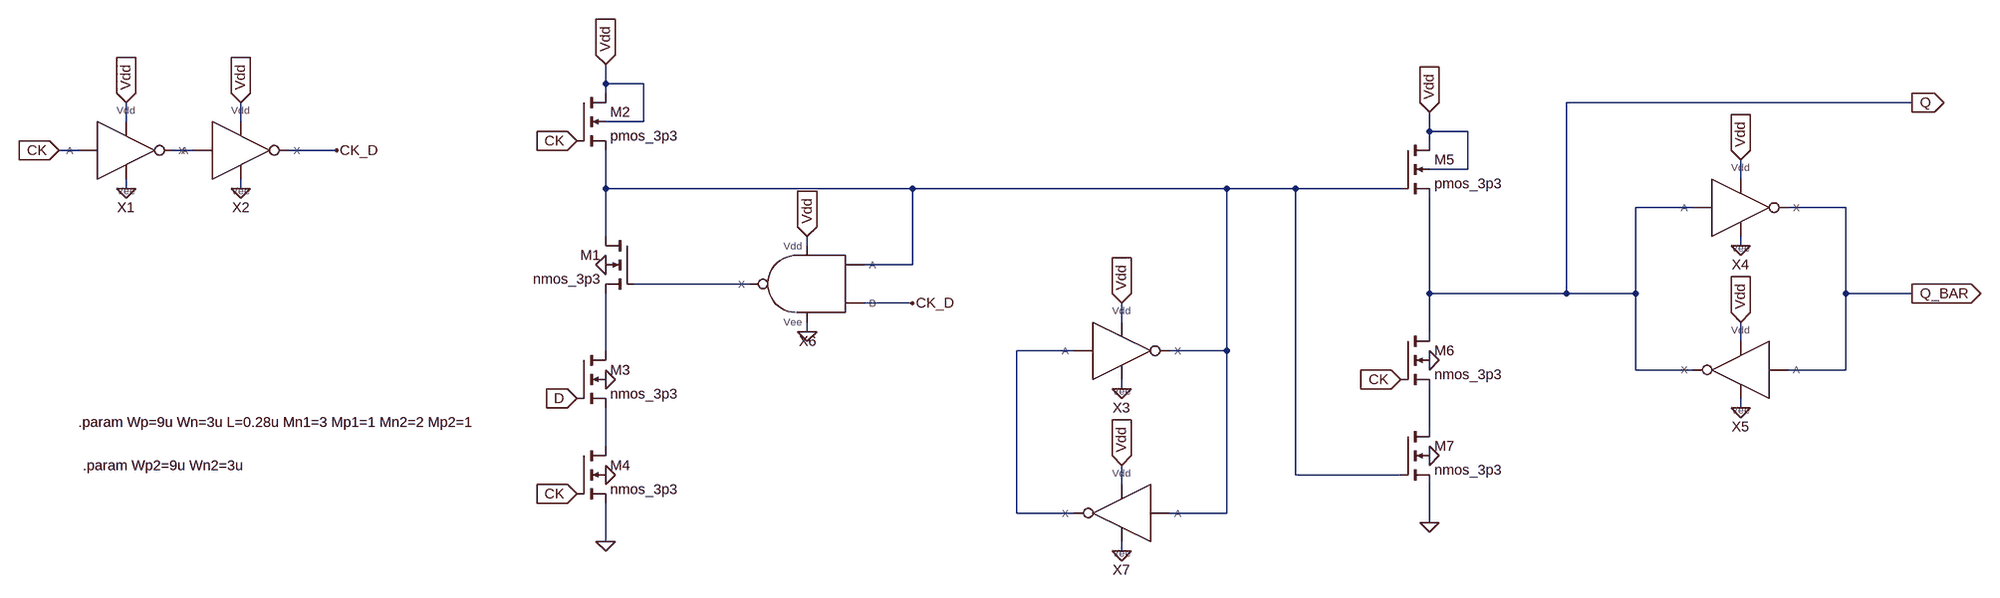
[diagram p0: schematic SDFF.asc]
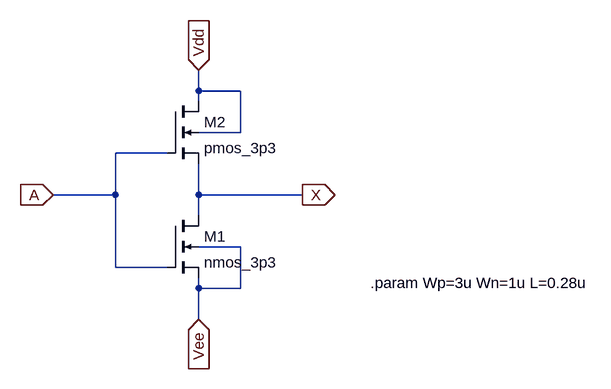
[diagram p1: sub-circuit invx1.asc]
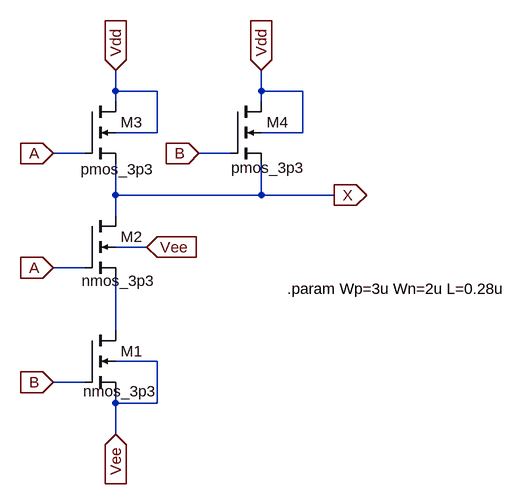
[diagram p2: sub-circuit nand2x1.asc]
SDFF.asc, the LTspice schematic file:
Version 4
SHEET 1 2380 680
WIRE -528 -304 -528 -336
WIRE -464 -304 -528 -304
WIRE -528 -288 -528 -304
WIRE 2240 -272 1488 -272
WIRE -1472 -240 -1472 -272
WIRE -1280 -240 -1280 -272
WIRE -464 -240 -464 -304
WIRE -464 -240 -528 -240
WIRE 1104 -224 1104 -256
WIRE 1168 -224 1104 -224
WIRE 1104 -208 1104 -224
WIRE -1552 -192 -1584 -192
WIRE -1360 -192 -1392 -192
WIRE -1120 -192 -1200 -192
WIRE 1168 -160 1168 -224
WIRE 1168 -160 1104 -160
WIRE 1888 -144 1888 -176
WIRE -1472 -128 -1472 -144
WIRE -1280 -128 -1280 -144
WIRE -528 -128 -528 -192
WIRE 32 -128 -528 -128
WIRE 640 -128 32 -128
WIRE 880 -128 640 -128
WIRE 1056 -128 880 -128
WIRE 1808 -96 1712 -96
WIRE 2064 -96 1968 -96
WIRE -528 -48 -528 -128
WIRE -144 -32 -144 -48
WIRE 1888 -32 1888 -48
WIRE 32 0 32 -128
WIRE 32 0 -48 0
WIRE -240 32 -480 32
WIRE 1104 48 1104 -112
WIRE 1488 48 1488 -272
WIRE 1488 48 1104 48
WIRE 1712 48 1712 -96
WIRE 1712 48 1488 48
WIRE 2064 48 2064 -96
WIRE 2240 48 2064 48
WIRE 32 64 -48 64
WIRE 464 96 464 64
WIRE -144 112 -144 96
WIRE 1104 112 1104 48
WIRE 1888 128 1888 96
WIRE -528 144 -528 48
WIRE 384 144 288 144
WIRE 640 144 640 -128
WIRE 640 144 544 144
WIRE 1712 176 1712 48
WIRE 1808 176 1712 176
WIRE 2064 176 2064 48
WIRE 2064 176 1968 176
WIRE 464 208 464 192
WIRE 1888 240 1888 224
WIRE 1104 272 1104 208
WIRE -528 304 -528 240
WIRE 880 352 880 -128
WIRE 1056 352 880 352
WIRE 464 368 464 336
WIRE 288 416 288 144
WIRE 384 416 288 416
WIRE 640 416 640 144
WIRE 640 416 544 416
WIRE 1104 432 1104 368
WIRE -528 464 -528 400
WIRE 464 480 464 464
FLAG -528 -336 Vdd
IOPIN -528 -336 In
FLAG -576 -208 CK
IOPIN -576 -208 In
FLAG -528 464 0
FLAG -576 224 D
IOPIN -576 224 In
FLAG -1472 -128 0
FLAG -1280 -128 0
FLAG -1472 -272 Vdd
IOPIN -1472 -272 In
FLAG -1280 -272 Vdd
IOPIN -1280 -272 In
FLAG -1584 -192 CK
IOPIN -1584 -192 In
FLAG -1120 -192 CK_D
FLAG 1888 -32 0
FLAG 1888 240 0
FLAG 1888 -176 Vdd
IOPIN 1888 -176 In
FLAG 1888 96 Vdd
IOPIN 1888 96 In
FLAG 2240 -272 Q
IOPIN 2240 -272 Out
FLAG 2240 48 Q_BAR
IOPIN 2240 48 Out
FLAG -528 352 0
FLAG -528 192 0
FLAG -528 0 0
FLAG 1104 -256 Vdd
IOPIN 1104 -256 In
FLAG 1104 432 0
FLAG 1104 320 0
FLAG 1104 160 0
FLAG -576 384 CK
IOPIN -576 384 In
FLAG 32 64 CK_D
FLAG -144 -48 Vdd
IOPIN -144 -48 In
FLAG -144 112 0
FLAG 464 208 0
FLAG 464 480 0
FLAG 464 64 Vdd
IOPIN 464 64 In
FLAG 464 336 Vdd
IOPIN 464 336 In
FLAG 1056 192 CK
IOPIN 1056 192 In
SYMBOL nmos4 -576 -288 R0
SYMATTR InstName M2
SYMATTR Value pmos_3p3
SYMATTR Value2 l={L} w={Wp} m={Mp1}
SYMBOL nmos4 -576 144 R0
SYMATTR InstName M3
SYMATTR Value nmos_3p3
SYMATTR Value2 l={L} w={Wn} m={Mn1}
SYMBOL nmos4 -576 304 R0
SYMATTR InstName M4
SYMATTR Value nmos_3p3
SYMATTR Value2 l={L} w={Wn} m={Mn1}
SYMBOL INVx1 -1472 -192 R0
SYMATTR InstName X1
SYMBOL INVx1 -1280 -192 R0
SYMATTR InstName X2
SYMBOL INVx1 1888 -96 R0
SYMATTR InstName X4
SYMBOL INVx1 1888 176 M0
SYMATTR InstName X5
SYMBOL nmos4 -480 -48 M0
SYMATTR InstName M1
SYMATTR Value nmos_3p3
SYMATTR Value2 l={L} w={Wn} m={Mn1}
SYMBOL NAND2x1 -144 32 M0
SYMATTR InstName X6
SYMBOL nmos4 1056 -208 R0
SYMATTR InstName M5
SYMATTR Value pmos_3p3
SYMATTR Value2 l={L} w={Wp2} m={Mp2}
SYMBOL nmos4 1056 112 R0
SYMATTR InstName M6
SYMATTR Value nmos_3p3
SYMATTR Value2 l={L} w={Wn2} m={Mn2}
SYMBOL nmos4 1056 272 R0
SYMATTR InstName M7
SYMATTR Value nmos_3p3
SYMATTR Value2 l={L} w={Wn2} m={Mn2}
SYMBOL INVx1 464 144 R0
SYMATTR InstName X3
SYMBOL INVx1 464 416 M0
SYMATTR InstName X7
TEXT -1552 264 Left 2 !.param Wp=9u Wn=3u L=0.28u Mn1=3 Mp1=1 Mn2=2 Mp2=1
TEXT -1544 336 Left 2 !.param Wp2=9u Wn2=3u

invx1.asc, the sub-circuit schematic file:
Version 4
SHEET 1 2776 836
WIRE 416 -16 416 -48
WIRE 480 -16 416 -16
WIRE 416 0 416 -16
WIRE 480 48 480 -16
WIRE 480 48 416 48
WIRE 368 80 288 80
WIRE 288 144 288 80
WIRE 288 144 192 144
WIRE 416 144 416 96
WIRE 576 144 416 144
WIRE 416 176 416 144
WIRE 480 224 416 224
WIRE 288 256 288 144
WIRE 368 256 288 256
WIRE 416 288 416 272
WIRE 480 288 480 224
WIRE 480 288 416 288
WIRE 416 336 416 288
FLAG 416 -48 Vdd
IOPIN 416 -48 In
FLAG 192 144 A
IOPIN 192 144 In
FLAG 576 144 X
IOPIN 576 144 Out
FLAG 416 336 Vee
IOPIN 416 336 In
SYMBOL nmos4 368 176 R0
SYMATTR InstName M1
SYMATTR Value nmos_3p3
SYMATTR Value2 l={L} w={Wn}
SYMBOL nmos4 368 0 R0
SYMATTR InstName M2
SYMATTR Value pmos_3p3
SYMATTR Value2 l={L} w={Wp}
TEXT 680 280 Left 2 !.param Wp=3u Wn=1u L=0.28u

nand2x1.asc, the sub-circuit schematic file:
Version 4.1
SHEET 1 900 680
WIRE -96 32 -96 0
WIRE -32 32 -96 32
WIRE 128 32 128 0
WIRE 192 32 128 32
WIRE -96 48 -96 32
WIRE 128 48 128 32
WIRE -32 96 -32 32
WIRE -32 96 -96 96
WIRE 192 96 192 32
WIRE 192 96 128 96
WIRE -144 128 -192 128
WIRE 80 128 32 128
WIRE -96 192 -96 144
WIRE 128 192 128 144
WIRE 128 192 -96 192
WIRE 240 192 128 192
WIRE -96 224 -96 192
WIRE -48 272 -96 272
WIRE -144 304 -192 304
WIRE -96 400 -96 320
WIRE -32 448 -96 448
WIRE -144 480 -192 480
WIRE -96 512 -96 496
WIRE -32 512 -32 448
WIRE -32 512 -96 512
WIRE -96 560 -96 512
FLAG -96 0 Vdd
IOPIN -96 0 In
FLAG -192 128 A
IOPIN -192 128 In
FLAG 240 192 X
IOPIN 240 192 Out
FLAG 128 0 Vdd
IOPIN 128 0 In
FLAG -192 304 A
IOPIN -192 304 In
FLAG -192 480 B
IOPIN -192 480 In
FLAG 32 128 B
IOPIN 32 128 In
FLAG -96 560 Vee
IOPIN -96 560 In
FLAG -48 272 Vee
IOPIN -48 272 In
SYMBOL nmos4 -144 400 R0
WINDOW 3 -2 94 Left 2
SYMATTR Value nmos_3p3
SYMATTR InstName M1
SYMATTR Value2 l={L} w={Wn}
SYMBOL nmos4 -144 48 R0
WINDOW 3 -6 104 Left 2
SYMATTR Value pmos_3p3
SYMATTR InstName M3
SYMATTR Value2 l={L} w={Wp}
SYMBOL nmos4 80 48 R0
WINDOW 3 2 102 Left 2
SYMATTR Value pmos_3p3
SYMATTR InstName M4
SYMATTR Value2 l={L} w={Wp}
SYMBOL nmos4 -144 224 R0
WINDOW 3 -4 100 Left 2
SYMATTR Value nmos_3p3
SYMATTR InstName M2
SYMATTR Value2 l={L} w={Wn}
TEXT 168 336 Left 2 !.param Wp=3u Wn=2u L=0.28u

The netlist it stands for:
* SDFF.asc
M2 Vdd CK N002 Vdd pmos_3p3 l={L} w={Wp} m={Mp1}
M3 N004 D N007 0 nmos_3p3 l={L} w={Wn} m={Mn1}
M4 N007 CK 0 0 nmos_3p3 l={L} w={Wn} m={Mn1}
XX1 CK Vdd N001 0 invx1
XX2 N001 Vdd CK_D 0 invx1
XX4 Q Vdd Q_BAR 0 invx1
XX5 Q_BAR Vdd Q 0 invx1
M1 N002 N003 N004 0 nmos_3p3 l={L} w={Wn} m={Mn1}
XX6 N002 CK_D Vdd N003 0 nand2x1
M5 Vdd N002 Q Vdd pmos_3p3 l={L} w={Wp2} m={Mp2}
M6 Q CK N006 0 nmos_3p3 l={L} w={Wn2} m={Mn2}
M7 N006 N002 0 0 nmos_3p3 l={L} w={Wn2} m={Mn2}
XX3 N005 Vdd N002 0 invx1
XX7 N002 Vdd N005 0 invx1

* block symbol definitions
.subckt invx1 A Vdd X Vee
M1 X A Vee Vee nmos_3p3 l={L} w={Wn}
M2 Vdd A X Vdd pmos_3p3 l={L} w={Wp}
.param Wp=3u Wn=1u L=0.28u
.ends invx1

.subckt nand2x1 A B Vdd X Vee
M1 N001 B Vee Vee nmos_3p3 l={L} w={Wn}
M3 Vdd A X Vdd pmos_3p3 l={L} w={Wp}
M4 Vdd B X Vdd pmos_3p3 l={L} w={Wp}
M2 X A N001 Vee nmos_3p3 l={L} w={Wn}
.param Wp=3u Wn=2u L=0.28u
.ends nand2x1

.model NMOS NMOS
.model PMOS PMOS
.lib standard.mos
.param Wp=9u Wn=3u L=0.28u Mn1=3 Mp1=1 Mn2=2 Mp2=1
.param Wp2=9u Wn2=3u
.backanno
.end